# Altium schematic sheet Digital.SchDoc
size A4; Date: 24-01-2023; Engineer: Christian Peppelman; Revision: V300; SheetNumber: 1; SheetTotal: 1; ProjectSheetName: Dental Sensor Hardware Demonstrator; SheetName: Digital
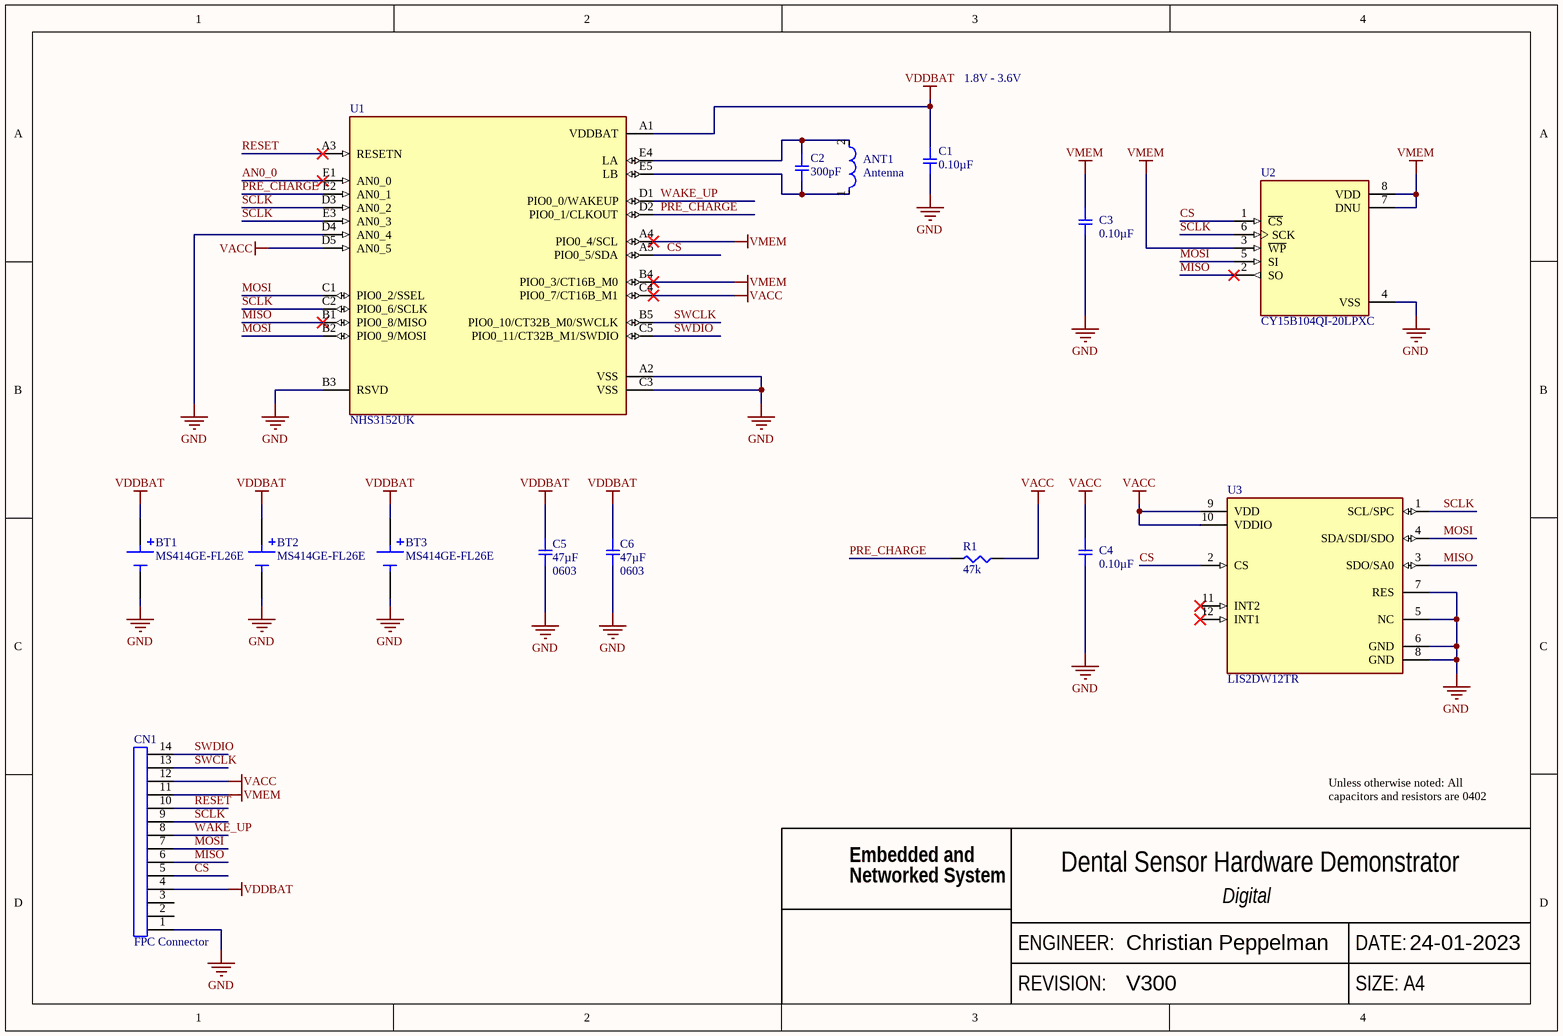
[diagram p0: Digital.SchDoc]

## Parts
ANT1  Antenna  [NFC Antenna]  (net tie, no BOM)
BT1  MS414GE-FL26E  [MS414GE-FL26E]
BT2  MS414GE-FL26E  [MS414GE-FL26E]
BT3  MS414GE-FL26E  [MS414GE-FL26E]
C1  0.10µF  [RESC1005X03N]
C2  300pF  [RESC1005X03N]
C3  0.10µF  [RESC1005X03N]
C4  0.10µF  [RESC1005X03N]
C5  47µF  Package / Case: 0603  [CAPC1608X12N]
C6  47µF  Package / Case: 0603  [CAPC1608X12N]
CN1  FPC Connector  [52745-1497]
R1  47k  [CAPC1005X03N]
U1  NHS3152UK  [WLCSP25]
U2  CY15B104QI-20LPXC  [8-GQFN]
U3  LIS2DW12TR  [FP-LGA12-DM00170568-MFG]

## Nets
GND: BT1.NEG BT2.NEG BT3.NEG C1.2 C3.2 C4.2 C5.2 C6.2 CN1.1 U1.A2(VSS) U1.B3(RSVD) U1.C3(VSS) U1.D4(AN0_4) U2.4(VSS) U3.5(NC) U3.6(GND) U3.7(RES) U3.8(GND)
VACC: C4.1 CN1.12 R1.1 U1.C4(PIO0_7/CT16B_M1) U1.D5(AN0_5) U3.9(VDD) U3.10(VDDIO)
VDDBAT: BT1.POS BT2.POS BT3.POS C1.1 C5.1 C6.1 CN1.4 U1.A1(VDDBAT)
VMEM: C3.1 CN1.11 U1.A4(PIO0_4/SCL) U1.B4(PIO0_3/CT16B_M0) U2.3(~{WP}) U2.7(DNU) U2.8(VDD)
AN0_0: U1.E1(AN0_0)
CS: CN1.5 U1.A5(PIO0_5/SDA) U2.1(~{CS}) U3.2(CS)
MISO: CN1.6 U1.B1(PIO0_8/MISO) U2.2(SO) U3.3(SDO/SA0)
MOSI: CN1.7 U1.B2(PIO0_9/MOSI) U1.C1(PIO0_2/SSEL) U2.5(SI) U3.4(SDA/SDI/SDO)
PRE_CHARGE: R1.2 U1.D2(PIO0_1/CLKOUT) U1.E2(AN0_1)
RESET: CN1.10 U1.A3(RESETN)
SCLK: CN1.9 U1.C2(PIO0_6/SCLK) U1.D3(AN0_2) U1.E3(AN0_3) U2.6(SCK) U3.1(SCL/SPC)
SWCLK: CN1.13 U1.B5(PIO0_10/CT32B_M0/SWCLK)
SWDIO: CN1.14 U1.C5(PIO0_11/CT32B_M1/SWDIO)
WAKE_UP: CN1.8 U1.D1(PIO0_0/WAKEUP)
NetANT1_1: ANT1.1 C2.2 U1.E5(LB)
NetANT1_2: ANT1.2 C2.1 U1.E4(LA)

Not connected (* = marked no-connect by the designer): CN1 2 3; U3 11(INT2)* 12(INT1)*

## Notes on the sheet
- 1.8V - 3.6V
- Unless otherwise noted: All capacitors and resistors are 0402
- Embedded and
- Networked System
- ENGINEER:
- DATE:
- REVISION:
- SIZE: A4

## Library data of the parts
ANT1 = NFC Antenna: Track 0.2; Gap 0.1; Height 4.6; Width 14.5;
BT1-BT3 = MS414GE-FL26E: Coin, 4.8mm 3V Lithium Battery Rechargeable (Secondary) 2mAh; MF: Seiko; MP: MS414GE-FL26E; Price: None; Package: Custom Package Seiko; Value: *; Availability: Unavailable; Mouser-Purchase-URL: https://snapeda.com/shop?store=Mouser&id=554618; SnapEDA_Link: https://www.snapeda.com/parts/MS414GE-FL26E/Seiko/view-part/554618/?ref=snap
C1 C3 C4 = GRM155R60J104KA01D: CAP CER 0.1UF 6.3V X5R 0402; Manufacturer: Murata Electronics North America; Factory Stock: 0; Unit Price (USD): 0.1; Minimum Quantity: 1; Tolerance: ±10%; Datasheets: http://www.murata.com/~/media/webrenewal/support/library/catalog/products/capacitor/mlcc/c02e.pdf; Image: //media.digikey.com/Renders/Murata%20Renders/ZRB-SERIES-0402.jpg; Digi-Key Part Number: 490-6287-1-ND; Part Number: GRM155R60J104KA01D; Quantity Available: 356062; @ qty: 0; Packaging: Cut Tape (CT); Series: GRM; Part Status: Active; Value: 0.10µF; Voltage: 6.3V; Temperature Coefficient: X5R; Operating Temperature: -55°C ~ 85°C; Features: -; Ratings: -; Applications: General Purpose; Mounting Type: Surface Mount, MLCC; Package / Case: 0402 (1005 Metric); Size / Dimension: 0.039" L x 0.020" W (1.00mm x 0.50mm); Height - Seated (Max): -; Thickness (Max): 0.022" (0.55mm); Lead Spacing: -
C2 = GRM1555C1H301JA01D: CAP CER 300PF 50V NP0 0402; Manufacturer: Murata Electronics North America; Factory Stock: 0; Unit Price (USD): 0.1; Minimum Quantity: 1; Tolerance: ±5%; Temperature Coefficient: C0G, NP0; Datasheets: http://www.murata.com/~/media/webrenewal/support/library/catalog/products/capacitor/mlcc/c02e.pdf; Image: //media.digikey.com/Renders/Murata%20Renders/ZRB-SERIES-0402.jpg; Digi-Key Part Number: 490-3234-1-ND; Part Number: GRM1555C1H301JA01D; Quantity Available: 73694; @ qty: 0; Packaging: Cut Tape (CT); Series: GRM; Part Status: Active; Value: 300pF; Voltage: 50V; Operating Temperature: -55°C ~ 125°C; Features: -; Ratings: -; Applications: General Purpose; Mounting Type: Surface Mount, MLCC; Package / Case: 0402 (1005 Metric); Size / Dimension: 0.039" L x 0.020" W (1.00mm x 0.50mm); Height - Seated (Max): -; Thickness (Max): 0.022" (0.55mm); Lead Spacing: -; Lead Style: -
C5 C6 = GRJ155R60J106ME11D: CAP CER 47UF 6.3V X5R 0603; Manufacturer: Murata Electronics North America; Factory Stock: 0; Unit Price (USD): 0.23; Minimum Quantity: 1; Tolerance: ±20%; Datasheets: http://psearch.en.murata.com/capacitor/product/GRJ155R60J106ME11%23.pdf; Image: //media.digikey.com/Renders/Murata%20Renders/ZRB-SERIES-0402.jpg; Digi-Key Part Number: 490-13211-1-ND; Part Number: GRJ155R60J106ME11D; Quantity Available: 64064; @ qty: 0; Packaging: Cut Tape (CT); Series: GRJ; Part Status: Active; Value: 47µF; Voltage: 6.3V; Temperature Coefficient: X5R; Operating Temperature: -55°C ~ 85°C; Features: Derating Recommended, Soft Termination; Ratings: -; Applications: Boardflex Sensitive; Mounting Type: Surface Mount, MLCC; Size / Dimension: 0.039" L x 0.020" W (1.00mm x 0.50mm); Height - Seated (Max): -; Thickness (Max): 0.028" (0.70mm); Lead Spacing: -; Lead Style: -
CN1 = 52745-1497: FFC / FPC Board Connector, 0.5 mm, 14 Contacts, Receptacle, Easy-On 52745, Surface Mount, Top
R1 = ERJ-2RKF4702X: RES SMD 47K OHM 1% 1/10W 0402; Manufacturer: Panasonic Electronic Components; Factory Stock: 0; Unit Price (USD): 0.00496; @ qty: 1500; Minimum Quantity: 1; Power (Watts): 0.1W, 1/10W; Temperature Coefficient: ±100ppm/°C; Part Number: ERJ-2RKF4702X; Datasheets: http://industrial.panasonic.com/www-cgi/jvcr13pz.cgi?E+PZ+3+AOA0002+ERJ2RKF4702X+7+WW; Image: //media.digikey.com/Photos/Panasonic%20Photos/ERJ-PA2-Series.jpg; Digi-Key Part Number: P47.0KLCT-ND; Quantity Available: 230515; Packaging: Cut Tape (CT); Series: ERJ; Part Status: Active; Value: 47k; Tolerance: ±1%; Composition: Thick Film; Features: Automotive AEC-Q200; Operating Temperature: -55°C ~ 155°C; Package / Case: 0402 (1005 Metric); Supplier Device Package: 0402; Size / Dimension: 0.039" L x 0.020" W (1.00mm x 0.50mm); Height - Seated (Max): 0.016" (0.40mm); Number of Terminations: 2; Failure Rate: -
U1 = NHS3152UK: ARM-microcontrollers - MCU NTAG NHS3152 NFC
U2 = CY15B104QI-20LPXC: FRAM (Ferroelectric RAM) Memory IC 4Mbit SPI 20 MHz 8-GQFN (3.23x3.28)
U3 = CMP-12175-000006-1: ACCEL 2-16G I2C/SPI 12LGA; Manufacturer: STMicroelectronics; Min Supply Voltage: 1.62V; Operating Supply Current: 0.38-90uA; Sensor Output: I2C,SPI; Accel Resolution: 14bits; Max Supply Voltage: 3.6V; Accel Range: 2/4/8/16g; Height: 0.7mm; Device Class L1: Sensors; RoHS: TRUE; Temperature Range Low: -40°C; Category: IC; Mouser Description: Accelerometer Triple ±2g/±4g/±8g/±16g 1.62V to 3.6V 0.244mg/digit/0.488mg/digit/0.976mg/digit/1.952mg/digit 12-Pin LG...; Digikey Description: ACCEL 2-16G I2C/SPI 12LGA; ComponentLink2URL: https://www.st.com/resource/en/datasheet/lis2dw12.pdf; Automotive: No; Manufacturer Part Number: LIS2DW12TR; Lead Free: Yes; Footprint Url: https://www.st.com/content/ccc/resource/technical/document/technical_note/73/17/9c/16/dd/96/4a/01/CD00134799.pdf/files/CD00134799.pdf/jcr:content/translations/en.CD00134799.pdf; Temperature: -40°C to +85°C; Device Class L3: Accelerometers; Package: LGA12-DM00170568; Temperature Range High: +85°C; Device Class L2: Motion Sensors; Octopart: https://octopart.com/lis2dw12tr-stmicroelectronics-77080925; ComponentLink2Description: Datasheet